# Altium project DVT-PowerAMP-Stage.PrjPcb
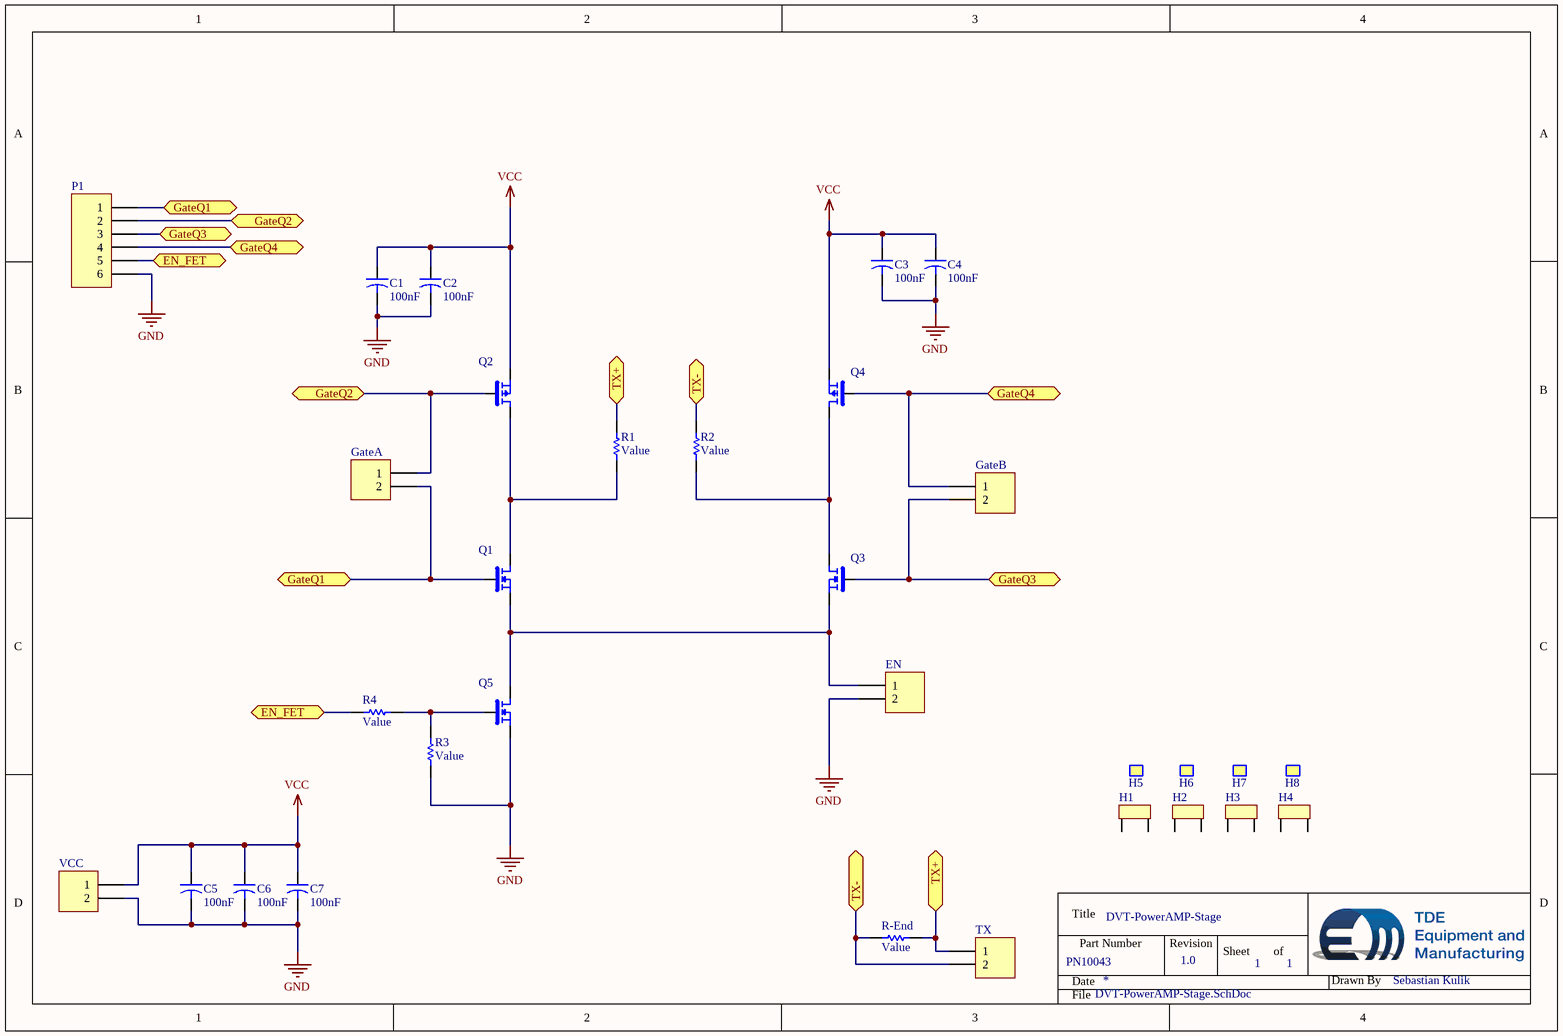
[diagram p0: DVT-PowerAMP-Stage.SchDoc]
1 sheet, 31 parts. Net scope: flat (ports and power ports of the same name join across sheets).
Board file: DVT-PowerAMP-Stage.PcbDoc

## Sheet DVT-PowerAMP-Stage.SchDoc: DVT-PowerAMP-Stage
size A4; PartNumber: PN10043; Drawn By: Sebastian Kulik

### Parts
C1  value 100nF  [Dummy-10mm]  (hidden comment: Capacitor-Dummy-THT)
C2  value 100nF  [Dummy-10mm]  (hidden comment: Capacitor-Dummy-THT)
C3  value 100nF  [Dummy-10mm]  (hidden comment: Capacitor-Dummy-THT)
C4  value 100nF  [Dummy-10mm]  (hidden comment: Capacitor-Dummy-THT)
C5  value 100nF  [Dummy-10mm]  (hidden comment: Capacitor-Dummy-THT)
C6  value 100nF  [Dummy-10mm]  (hidden comment: Capacitor-Dummy-THT)
C7  value 100nF  [Dummy-10mm]  (hidden comment: Capacitor-Dummy-THT)
EN  PHOENIX_1715721  [HDR1X2]  (value not drawn)
GateA  Plug_2_90_2.54  [HDR1X2]  (value not drawn)
GateB  Plug_2_90_2.54  [HDR1X2]  (value not drawn)
H1  SK129-25,4-STS-220  [SK129-25,4-STS-220]  (value not drawn)
H2  SK129-25,4-STS-220  [SK129-25,4-STS-220]  (value not drawn)
H3  SK129-25,4-STS-220  [SK129-25,4-STS-220]  (value not drawn)
H4  SK129-25,4-STS-220  [SK129-25,4-STS-220]  (value not drawn)
H5  Fischer-Clamp  (value not drawn)
H6  Fischer-Clamp  (value not drawn)
H7  Fischer-Clamp  (value not drawn)
H8  Fischer-Clamp  (value not drawn)
P1  Plug_06_2.54  [HDR1X6_2.54]  (value not drawn)
Q1  CHT-NMOS4010-TO254-T  [TO254]  (value not drawn)
Q2  CHT-PMOS3008-TO254-T  [TO254]  (value not drawn)
Q3  CHT-NMOS4010-TO254-T  [TO254]  (value not drawn)
Q4  CHT-PMOS3008-TO254-T  [TO254]  (value not drawn)
Q5  CHT-NMOS4010-TO254-T  [TO254]  (value not drawn)
R1  Resistor-Dummy-THT  [Dummy-15mm]  (value not drawn)
R2  Resistor-Dummy-THT  [Dummy-15mm]  (value not drawn)
R3  Resistor-Dummy-THT  [Dummy-10mm]  (value not drawn)
R4  Resistor-Dummy-THT  [Dummy-10mm]  (value not drawn)
R-End  Resistor-Dummy-THT  [Dummy-10mm]  (value not drawn)
TX  PHOENIX_1715721  [Phoenix-2-5_08]  (value not drawn)
VCC  PHOENIX_1715721  [Phoenix-2-5_08]  (value not drawn)

### Ports
EN_FET, GateQ1, GateQ2, GateQ3, GateQ4, TX+, TX-

### Nets
GND: C1.2 C2.2 C3.2 C4.2 C5.2 C6.2 C7.2 EN.2 P1.6 Q5.Source R3.1 VCC.2
VCC: C1.1 C2.1 C3.1 C4.1 C5.1 C6.1 C7.1 Q2.Source Q4.Source VCC.1
NetEN_1: EN.1 Q1.Source Q3.Source Q5.Drain
NetGateA_1: GateA.1 P1.2 Q2.Gate ; port GateQ2
NetGateA_2: GateA.2 P1.1 Q1.Gate ; port GateQ1
NetGateB_1: GateB.1 P1.4 Q4.Gate ; port GateQ4
NetGateB_2: GateB.2 P1.3 Q3.Gate ; port GateQ3
NetP1_5: P1.5 R4.2 ; port EN_FET
NetQ1_Drain: Q1.Drain Q2.Drain R1.1
NetQ3_Drain: Q3.Drain Q4.Drain R2.1
NetQ5_Gate: Q5.Gate R3.2 R4.1
NetR1_2: R1.2 R-End.2 TX.1 ; port TX+
NetR2_2: R2.2 R-End.1 TX.2 ; port TX-

Not connected (* = marked no-connect by the designer): H1 1 2; H2 1 2; H3 1 2; H4 1 2

### Notes on the sheet
- 1.0
- 1
- Title
- Date
- Part Number
- Revision
- Sheet
- of
- Drawn By
- File

### Library data of the parts
C1-C7 = Capacitor-Dummy-THT: Deliverer PartNr: 699-5027; Manufacturer: AVX; Manufacturer PartNr: SR205E104MARTR; Deliverer: RS; Published: 08.12.2015; Part Description: Capacitor-Dummy-THT; Publisher: Sebastian Kulik; PackageDescription: -; TDE-PN: -
EN GateA GateB = Plug_2_90_2.54: Plug, 2-Pin; Manufacturer PartNr: 61300211021; Manufacturer: WE; Deliverer PartNr: 2356176; Deliverer: Farnell; TDE-PN: CON0010; LatestRevisionDate: 14.05.2014; LatestRevisionNote: Re-released for DXP Platform.; Publisher: Sebastian Kulik
H1-H4 = SK129-25,4-STS-220: Heatsink, 6.5K/W, TO220; Deliverer PartNr: 189-8139; Manufacturer: Fischer Elektronik; TDE-PN: DIS0050; Deliverer: RS; Published: 11.05.2016; Publisher: Sebastian Kulik; PackageDescription: SK129-25,4-STS-220; Manufacturer PartNr: SK129-25,4-STS-220; Price: 1.82
H5-H8 = Fischer-Clamp: Deliverer PartNr: 504-0592; Manufacturer PartNr: THFM1; Manufacturer: Fischer Elektronik; Deliverer: RS; TDE-PN: M0014; Published: 11.05.2016; Publisher: Sebastian Kulik; Price: 0.156/10
P1 = Plug_06_2.54: Plug, 08-Pin; Manufacturer PartNr: 61300611121; Manufacturer: WE; TDE-PN: CON0039; LatestRevisionDate: 11.11.2014; LatestRevisionNote: Re-released for DXP Platform.; Publisher: Sebastian Kulik; Deliverer: WE; Deliverer PartNr: 61300611121
Q1 Q3 Q5 = CHT-NMOS4010-TO254-T: N-FET, 40V@ 10A, Saturn series; Manufacturer: CISSOID; TDE-PN: DIS0043; Deliverer: Future; Published: 09.12.2015; Publisher: Sebastian Kulik; PackageDescription: TO254; Manufacturer PartNr: CHT-NMOS4010-TO254-T; Deliverer PartNr: CHT-NMOS4010-TO254-T; Price: 408.62
Q2 Q4 = CHT-PMOS3008-TO254-T: P-FET, 30V@ 8A, Venus series; Manufacturer: CISSOID; TDE-PN: DIS0048; Deliverer: Future; Published: 11.05.2016; Publisher: Sebastian Kulik; PackageDescription: TO254; Manufacturer PartNr: CHT-PMOS3008-TO254-T; Deliverer PartNr: CHT-PMOS3008-TO254-T; Price: 416.62
TX VCC = 2Pol_1715721: Phoenix, 2 pol, 5.08mm, 22A, 715721; Deliverer PartNr: 193-0564; Deliverer: RS; TDE-PN: CON0008; LatestRevisionDate: 02.05.2014; LatestRevisionNote: Re-released for DXP Platform.; Publisher: Sebastian Kulik; Manufacturer PartNr: 1715721; Manufacturer: Phoenix; PackageDescription: Phoenix-2-5_08
R1-R4 R-End = Resistor-Dummy-THT: Published: 08.12.2015; Publisher: Sebastian Kulik; PackageDescription: -; Manufacturer: -; Manufacturer PartNr: -; TDE-PN: -; Deliverer PartNr: -; Deliverer: -; Part Desicription: Resistor-Dummy-THT; Value: Value